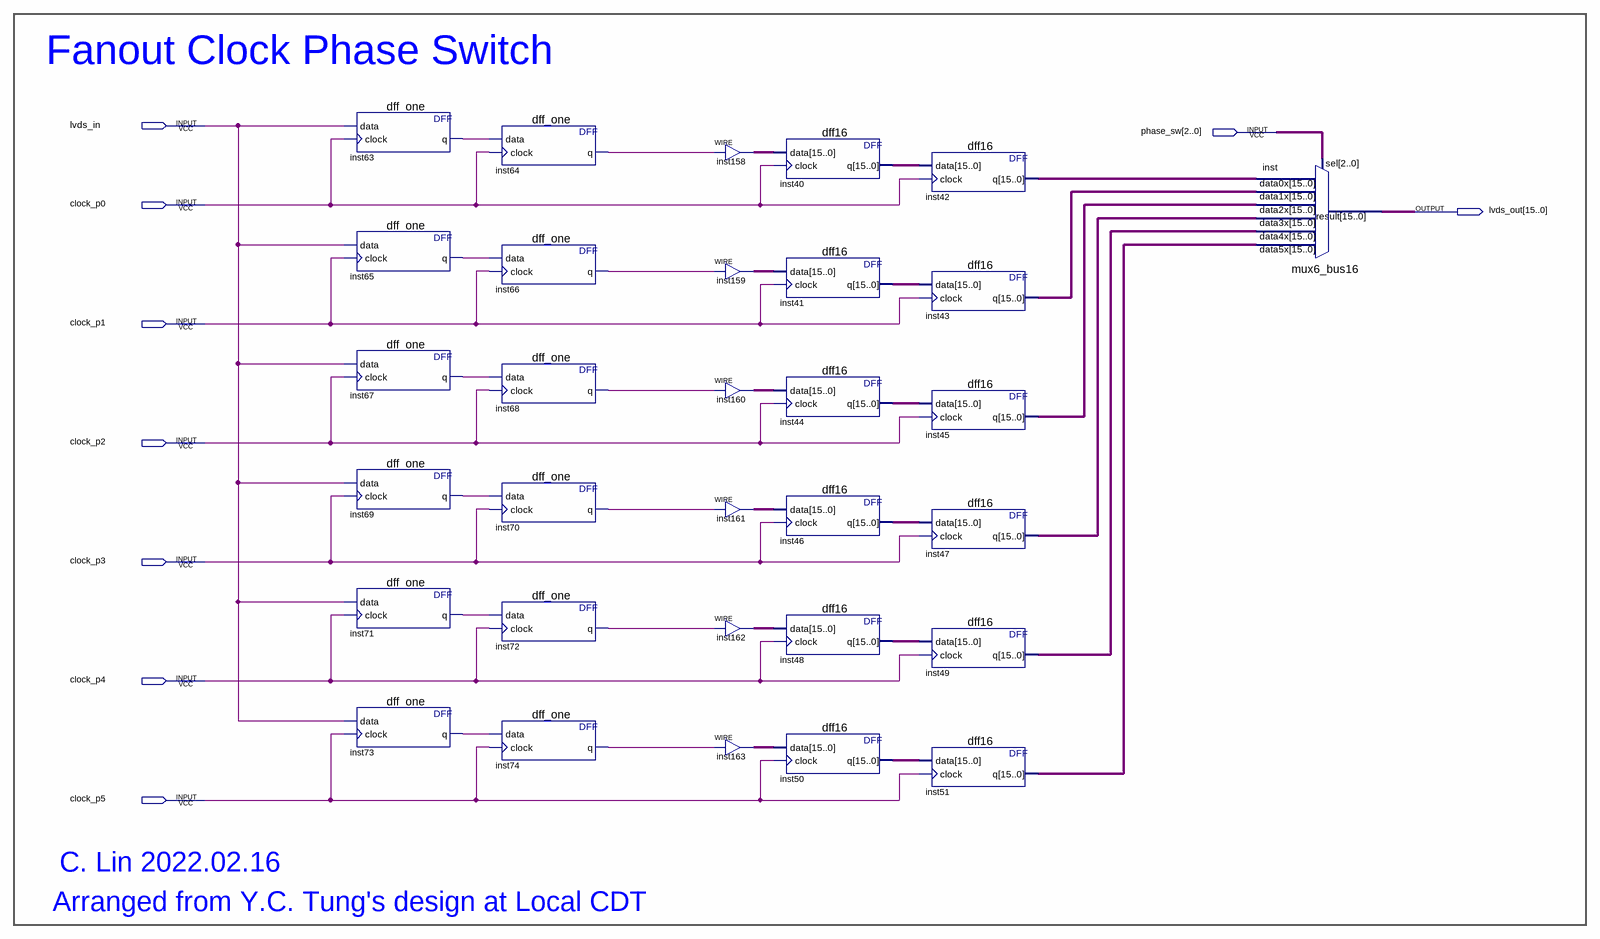
[diagram p0: schematic sheet]
// Quartus schematic fanout_clock_phase_sw.bdf as structural Verilog: 31 symbols, 9 pins
module fanout_clock_phase_sw (
  input  lvds_in,
  input  [2:0] phase_sw,
  input  clock_p0,
  input  clock_p1,
  input  clock_p2,
  input  clock_p3,
  input  clock_p4,
  input  clock_p5,
  output [15:0] lvds_out
);

  wire inst63_q, inst64_q, inst65_q, inst66_q, inst67_q, inst68_q, inst69_q, inst70_q, inst71_q, inst72_q,
       inst73_q, inst74_q;
  wire [15:0] inst40_q, inst41_q, inst42_q, inst43_q, inst44_q, inst45_q, inst46_q, inst47_q, inst48_q,
       inst49_q, inst50_q, inst51_q, inst158_out, inst159_out, inst160_out, inst161_out, inst162_out,
       inst163_out;

  dff_one inst63 (.data(lvds_in), .clock(clock_p0), .q(inst63_q));
  dff_one inst65 (.data(lvds_in), .clock(clock_p1), .q(inst65_q));
  dff_one inst67 (.data(lvds_in), .clock(clock_p2), .q(inst67_q));
  dff_one inst69 (.data(lvds_in), .clock(clock_p3), .q(inst69_q));
  dff_one inst71 (.data(lvds_in), .clock(clock_p4), .q(inst71_q));
  dff_one inst73 (.data(lvds_in), .clock(clock_p5), .q(inst73_q));
  dff_one inst64 (.data(inst63_q), .clock(clock_p0), .q(inst64_q));
  dff_one inst66 (.data(inst65_q), .clock(clock_p1), .q(inst66_q));
  dff_one inst68 (.data(inst67_q), .clock(clock_p2), .q(inst68_q));
  dff_one inst70 (.data(inst69_q), .clock(clock_p3), .q(inst70_q));
  dff_one inst72 (.data(inst71_q), .clock(clock_p4), .q(inst72_q));
  dff_one inst74 (.data(inst73_q), .clock(clock_p5), .q(inst74_q));
  assign inst158_out = {16{inst64_q}};  // WIRE inst158
  assign inst159_out = {16{inst66_q}};  // WIRE inst159
  assign inst160_out = {16{inst68_q}};  // WIRE inst160
  assign inst161_out = {16{inst70_q}};  // WIRE inst161
  assign inst162_out = {16{inst72_q}};  // WIRE inst162
  assign inst163_out = {16{inst74_q}};  // WIRE inst163
  dff16 inst40 (.data(inst158_out), .clock(clock_p0), .q(inst40_q));
  dff16 inst41 (.data(inst159_out), .clock(clock_p1), .q(inst41_q));
  dff16 inst44 (.data(inst160_out), .clock(clock_p2), .q(inst44_q));
  dff16 inst46 (.data(inst161_out), .clock(clock_p3), .q(inst46_q));
  dff16 inst48 (.data(inst162_out), .clock(clock_p4), .q(inst48_q));
  dff16 inst50 (.data(inst163_out), .clock(clock_p5), .q(inst50_q));
  dff16 inst42 (.data(inst40_q), .clock(clock_p0), .q(inst42_q));
  dff16 inst43 (.data(inst41_q), .clock(clock_p1), .q(inst43_q));
  dff16 inst45 (.data(inst44_q), .clock(clock_p2), .q(inst45_q));
  dff16 inst47 (.data(inst46_q), .clock(clock_p3), .q(inst47_q));
  dff16 inst49 (.data(inst48_q), .clock(clock_p4), .q(inst49_q));
  dff16 inst51 (.data(inst50_q), .clock(clock_p5), .q(inst51_q));
  mux6_bus16 inst (
    .data5x(inst51_q), .data4x(inst49_q), .data3x(inst47_q), .data2x(inst45_q), .data1x(inst43_q),
    .data0x(inst42_q), .sel(phase_sw), .result(lvds_out));

  // Notes on the sheet:
  //   Fanout Clock Phase Switch
  //   C. Lin 2022.02.16
  //   Arranged from Y.C. Tung's design at Local CDT
endmodule
